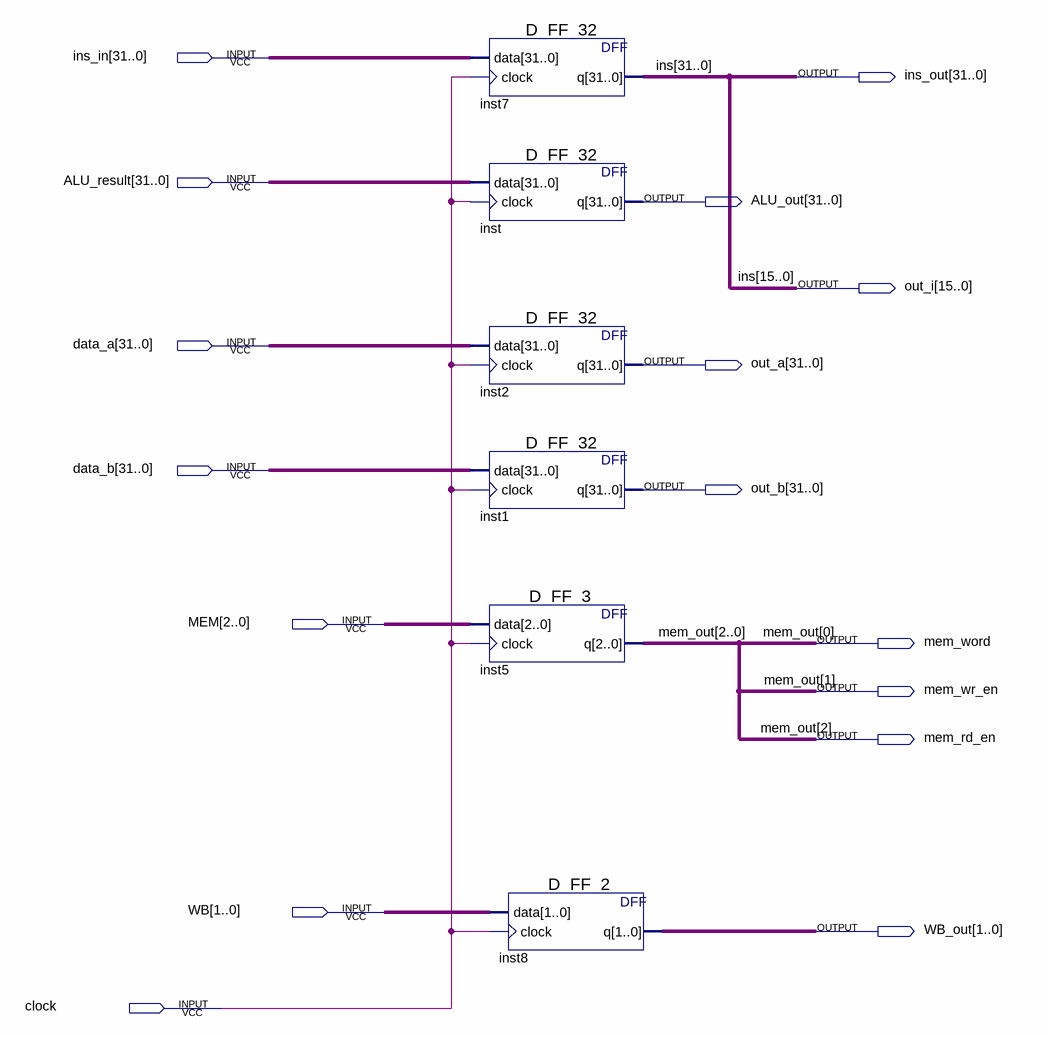
[diagram p0: schematic sheet]
// Quartus schematic EX_MEM.bdf as structural Verilog: 6 symbols, 16 pins
module EX_MEM (
  input  [31:0] ins_in,
  input  [31:0] ALU_result,
  input  [31:0] data_a,
  input  [31:0] data_b,
  input  [2:0] MEM,
  input  [1:0] WB,
  input  clock,
  output [31:0] ins_out,
  output [31:0] ALU_out,
  output [15:0] out_i,
  output [31:0] out_a,
  output [31:0] out_b,
  output mem_word,
  output mem_wr_en,
  output mem_rd_en,
  output [1:0] WB_out
);

  D_FF_32 inst7 (.data(ins_in), .clock(clock), .q(ins_out));
  D_FF_32 inst (.data(ALU_result), .clock(clock), .q(ALU_out));
  D_FF_32 inst2 (.data(data_a), .clock(clock), .q(out_a));
  D_FF_32 inst1 (.data(data_b), .clock(clock), .q(out_b));
  D_FF_3 inst5 (.data(MEM), .clock(clock), .q({mem_rd_en, mem_wr_en, mem_word}));
  D_FF_2 inst8 (.data(WB), .clock(clock), .q(WB_out));

  assign out_i = ins_out[15:0];

  // Other names for the same wires on the sheet: ins[31:0] = ins_out; mem_out[2:0] = {mem_rd_en, mem_wr_en, mem_word}
endmodule
